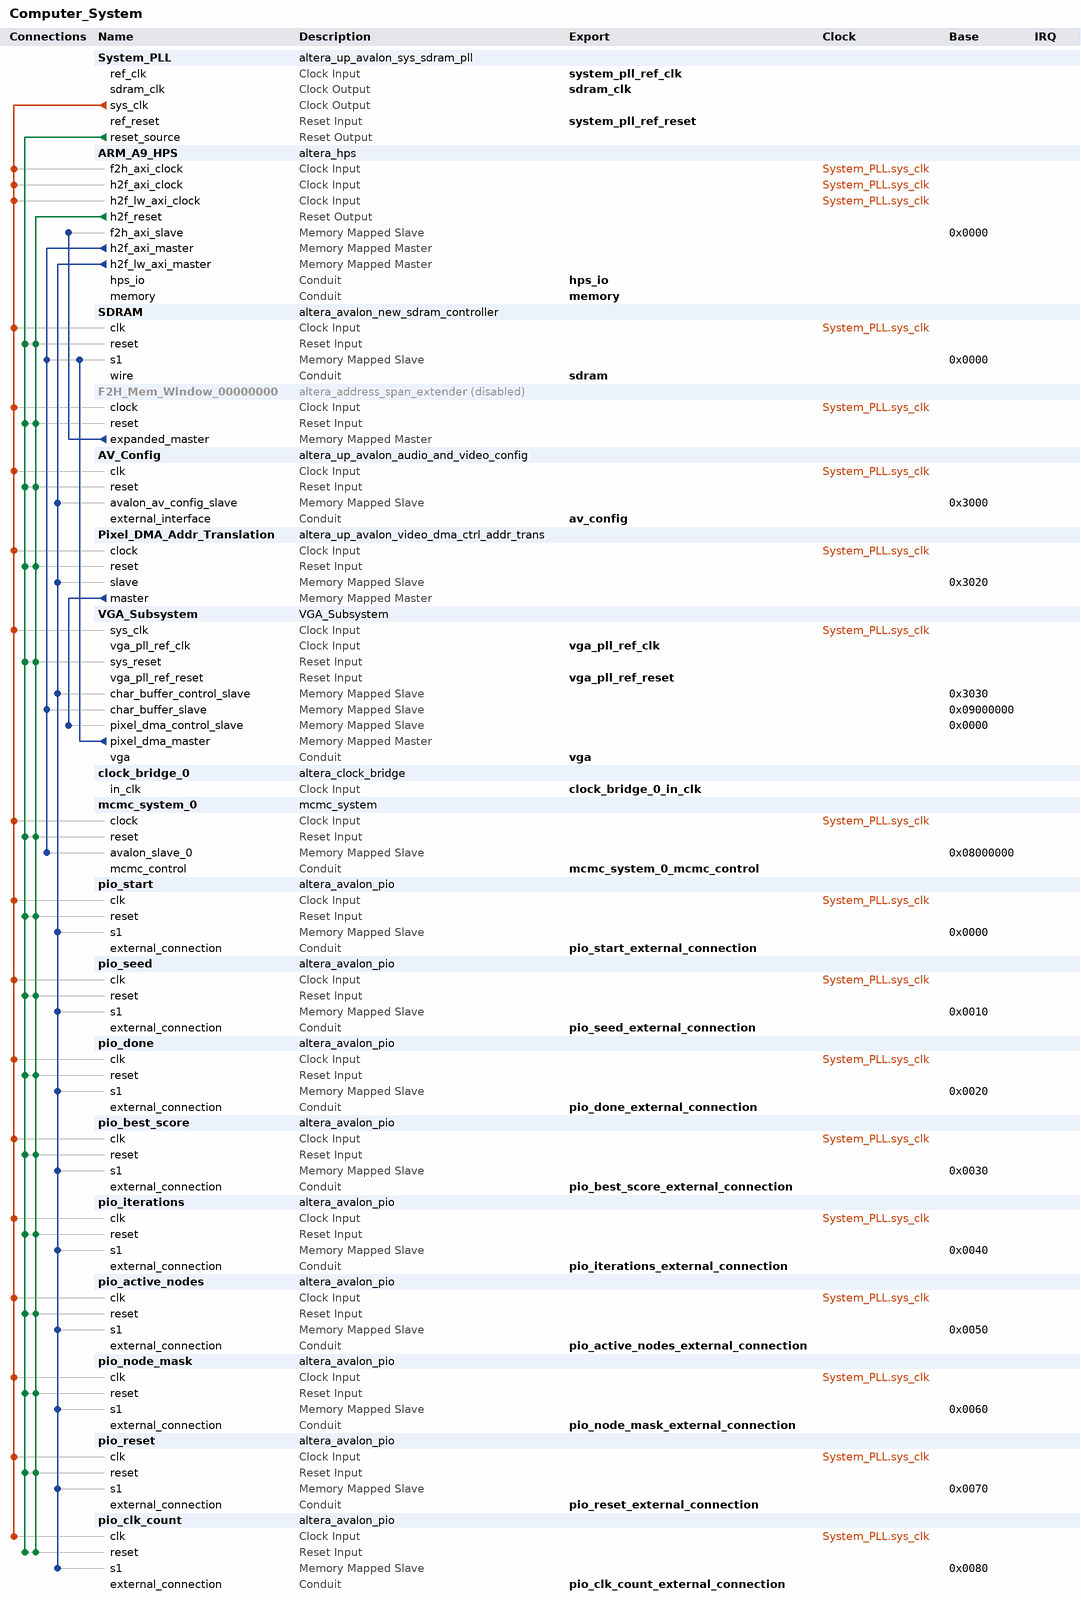
[diagram p0: system contents]
# Platform Designer (Qsys) system Computer_System, Cyclone V 5CSEMA5F31C6
# Parameters at their usual value, and those the tool derives, are not listed.
package require -exact qsys 18.1
create_system Computer_System
set_project_property DEVICE_FAMILY {Cyclone V}
set_project_property DEVICE 5CSEMA5F31C6

add_instance System_PLL altera_up_avalon_sys_sdram_pll 18.0
set_instance_parameter_value System_PLL CV_boards DE1-SoC
set_instance_parameter_value System_PLL gui_outclk 100.0
set_instance_parameter_value System_PLL gui_refclk 50.0

add_instance ARM_A9_HPS altera_hps 18.1
set_instance_parameter_value ARM_A9_HPS EMAC1_Mode RGMII
set_instance_parameter_value ARM_A9_HPS EMAC1_PinMuxing {HPS I/O Set 0}
set_instance_parameter_value ARM_A9_HPS F2SCLK_COLDRST_Enable false
set_instance_parameter_value ARM_A9_HPS F2SCLK_DBGRST_Enable false
set_instance_parameter_value ARM_A9_HPS F2SCLK_WARMRST_Enable false
set_instance_parameter_value ARM_A9_HPS F2SINTERRUPT_Enable true
set_instance_parameter_value ARM_A9_HPS F2S_Width 2
set_instance_parameter_value ARM_A9_HPS FPGA_PERIPHERAL_OUTPUT_CLOCK_FREQ_EMAC0_GTX_CLK 125
set_instance_parameter_value ARM_A9_HPS FPGA_PERIPHERAL_OUTPUT_CLOCK_FREQ_EMAC0_MD_CLK 100.0
set_instance_parameter_value ARM_A9_HPS FPGA_PERIPHERAL_OUTPUT_CLOCK_FREQ_EMAC1_GTX_CLK 125
set_instance_parameter_value ARM_A9_HPS FPGA_PERIPHERAL_OUTPUT_CLOCK_FREQ_EMAC1_MD_CLK 100.0
set_instance_parameter_value ARM_A9_HPS HPS_PROTOCOL DDR3
set_instance_parameter_value ARM_A9_HPS I2C0_Mode I2C
set_instance_parameter_value ARM_A9_HPS I2C0_PinMuxing {HPS I/O Set 0}
set_instance_parameter_value ARM_A9_HPS I2C1_Mode I2C
set_instance_parameter_value ARM_A9_HPS I2C1_PinMuxing {HPS I/O Set 0}
set_instance_parameter_value ARM_A9_HPS LWH2F_Enable true
set_instance_parameter_value ARM_A9_HPS MEM_BANKADDR_WIDTH 3
set_instance_parameter_value ARM_A9_HPS MEM_CLK_FREQ 400.0
set_instance_parameter_value ARM_A9_HPS MEM_COL_ADDR_WIDTH 10
set_instance_parameter_value ARM_A9_HPS MEM_DQ_WIDTH 32
set_instance_parameter_value ARM_A9_HPS MEM_DRV_STR RZQ/7
set_instance_parameter_value ARM_A9_HPS MEM_ROW_ADDR_WIDTH 15
set_instance_parameter_value ARM_A9_HPS MEM_RTT_NOM RZQ/4
set_instance_parameter_value ARM_A9_HPS MEM_RTT_WR RZQ/4
set_instance_parameter_value ARM_A9_HPS MEM_TCL 11
set_instance_parameter_value ARM_A9_HPS MEM_TFAW_NS 30.0
set_instance_parameter_value ARM_A9_HPS MEM_TRAS_NS 35.0
set_instance_parameter_value ARM_A9_HPS MEM_TRCD_NS 13.75
set_instance_parameter_value ARM_A9_HPS MEM_TRFC_NS 260.0
set_instance_parameter_value ARM_A9_HPS MEM_TRP_NS 13.75
set_instance_parameter_value ARM_A9_HPS MEM_VENDOR JEDEC
set_instance_parameter_value ARM_A9_HPS MEM_WTCL 8
set_instance_parameter_value ARM_A9_HPS QSPI_Mode {1 SS}
set_instance_parameter_value ARM_A9_HPS QSPI_PinMuxing {HPS I/O Set 0}
set_instance_parameter_value ARM_A9_HPS REF_CLK_FREQ 25.0
set_instance_parameter_value ARM_A9_HPS S2FCLK_USER2CLK 5
set_instance_parameter_value ARM_A9_HPS S2F_Width 3
set_instance_parameter_value ARM_A9_HPS SDIO_Mode {4-bit Data}
set_instance_parameter_value ARM_A9_HPS SDIO_PinMuxing {HPS I/O Set 0}
set_instance_parameter_value ARM_A9_HPS SPIM1_Mode {Single Slave Select}
set_instance_parameter_value ARM_A9_HPS SPIM1_PinMuxing {HPS I/O Set 0}
set_instance_parameter_value ARM_A9_HPS STM_Enable false
set_instance_parameter_value ARM_A9_HPS TIMING_BOARD_AC_SKEW 0.03
set_instance_parameter_value ARM_A9_HPS TIMING_BOARD_AC_TO_CK_SKEW 0.0
set_instance_parameter_value ARM_A9_HPS TIMING_BOARD_DQ_TO_DQS_SKEW 0.0
set_instance_parameter_value ARM_A9_HPS TIMING_BOARD_MAX_CK_DELAY 0.03
set_instance_parameter_value ARM_A9_HPS TIMING_BOARD_MAX_DQS_DELAY 0.02
set_instance_parameter_value ARM_A9_HPS TIMING_BOARD_SKEW_BETWEEN_DQS 0.08
set_instance_parameter_value ARM_A9_HPS TIMING_BOARD_SKEW_CKDQS_DIMM_MAX 0.16
set_instance_parameter_value ARM_A9_HPS TIMING_BOARD_SKEW_CKDQS_DIMM_MIN 0.09
set_instance_parameter_value ARM_A9_HPS TIMING_BOARD_SKEW_WITHIN_DQS 0.01
set_instance_parameter_value ARM_A9_HPS TIMING_TDH 65
set_instance_parameter_value ARM_A9_HPS TIMING_TDQSCK 255
set_instance_parameter_value ARM_A9_HPS TIMING_TDQSQ 125
set_instance_parameter_value ARM_A9_HPS TIMING_TDS 30
set_instance_parameter_value ARM_A9_HPS TIMING_TIH 140
set_instance_parameter_value ARM_A9_HPS TIMING_TIS 180
set_instance_parameter_value ARM_A9_HPS TIMING_TQSH 0.4
set_instance_parameter_value ARM_A9_HPS UART0_Mode {No Flow Control}
set_instance_parameter_value ARM_A9_HPS UART0_PinMuxing {HPS I/O Set 0}
set_instance_parameter_value ARM_A9_HPS USB1_Mode SDR
set_instance_parameter_value ARM_A9_HPS USB1_PinMuxing {HPS I/O Set 0}
set_instance_parameter_value ARM_A9_HPS desired_cfg_clk_mhz 100.0
set_instance_parameter_value ARM_A9_HPS desired_qspi_clk_mhz 400.0

add_instance SDRAM altera_avalon_new_sdram_controller 18.1
set_instance_parameter_value SDRAM TAC 5.5
set_instance_parameter_value SDRAM TRCD 20.0
set_instance_parameter_value SDRAM TRP 20.0
set_instance_parameter_value SDRAM casLatency 3
set_instance_parameter_value SDRAM columnWidth 10
set_instance_parameter_value SDRAM dataWidth 16
set_instance_parameter_value SDRAM generateSimulationModel true
set_instance_parameter_value SDRAM model single_Micron_MT48LC4M32B2_7_chip
set_instance_parameter_value SDRAM numberOfBanks 4
set_instance_parameter_value SDRAM numberOfChipSelects 1
set_instance_parameter_value SDRAM powerUpDelay 100.0
set_instance_parameter_value SDRAM refreshPeriod 15.625
set_instance_parameter_value SDRAM rowWidth 13

add_instance F2H_Mem_Window_00000000 altera_address_span_extender 18.1
set_instance_property F2H_Mem_Window_00000000 ENABLED false
set_instance_parameter_value F2H_Mem_Window_00000000 BURSTCOUNT_WIDTH 1
set_instance_parameter_value F2H_Mem_Window_00000000 DATA_WIDTH 32
set_instance_parameter_value F2H_Mem_Window_00000000 ENABLE_SLAVE_PORT false
set_instance_parameter_value F2H_Mem_Window_00000000 MASTER_ADDRESS_DEF 0
set_instance_parameter_value F2H_Mem_Window_00000000 MAX_PENDING_READS 1
set_instance_parameter_value F2H_Mem_Window_00000000 SLAVE_ADDRESS_WIDTH 28

add_instance AV_Config altera_up_avalon_audio_and_video_config 18.0
set_instance_parameter_value AV_Config audio_in {Microphone to ADC}
set_instance_parameter_value AV_Config bit_length 32
set_instance_parameter_value AV_Config board DE1-SoC
set_instance_parameter_value AV_Config line_in_bypass false
set_instance_parameter_value AV_Config sampling_rate {48 kHz}

add_instance Pixel_DMA_Addr_Translation altera_up_avalon_video_dma_ctrl_addr_trans 18.0

add_instance VGA_Subsystem VGA_Subsystem 1.0

add_instance clock_bridge_0 altera_clock_bridge 18.1
set_instance_parameter_value clock_bridge_0 DERIVED_CLOCK_RATE 0
set_instance_parameter_value clock_bridge_0 EXPLICIT_CLOCK_RATE 50000000

add_instance mcmc_system_0 mcmc_system 1.0
set_instance_parameter_value mcmc_system_0 N_CHAINS 1
set_instance_parameter_value mcmc_system_0 N_NODES 32

add_instance pio_start altera_avalon_pio 18.1
set_instance_parameter_value pio_start direction Output
set_instance_parameter_value pio_start width 32

add_instance pio_seed altera_avalon_pio 18.1
set_instance_parameter_value pio_seed direction Output
set_instance_parameter_value pio_seed width 32

add_instance pio_done altera_avalon_pio 18.1
set_instance_parameter_value pio_done direction Input
set_instance_parameter_value pio_done width 32

add_instance pio_best_score altera_avalon_pio 18.1
set_instance_parameter_value pio_best_score direction Input
set_instance_parameter_value pio_best_score width 32

add_instance pio_iterations altera_avalon_pio 18.1
set_instance_parameter_value pio_iterations direction Output
set_instance_parameter_value pio_iterations width 32

add_instance pio_active_nodes altera_avalon_pio 18.1
set_instance_parameter_value pio_active_nodes direction Output
set_instance_parameter_value pio_active_nodes width 32

add_instance pio_node_mask altera_avalon_pio 18.1
set_instance_parameter_value pio_node_mask direction Output
set_instance_parameter_value pio_node_mask width 32

add_instance pio_reset altera_avalon_pio 18.1
set_instance_parameter_value pio_reset direction Output
set_instance_parameter_value pio_reset width 32

add_instance pio_clk_count altera_avalon_pio 18.1
set_instance_parameter_value pio_clk_count direction Input
set_instance_parameter_value pio_clk_count width 32

# connections
add_connection System_PLL.sys_clk ARM_A9_HPS.f2h_axi_clock clock
add_connection System_PLL.sys_clk ARM_A9_HPS.h2f_axi_clock clock
add_connection System_PLL.sys_clk ARM_A9_HPS.h2f_lw_axi_clock clock
add_connection System_PLL.sys_clk AV_Config.clk clock
add_connection System_PLL.sys_clk F2H_Mem_Window_00000000.clock clock
add_connection System_PLL.sys_clk mcmc_system_0.clock clock
add_connection System_PLL.sys_clk pio_active_nodes.clk clock
add_connection System_PLL.sys_clk pio_best_score.clk clock
add_connection System_PLL.sys_clk pio_clk_count.clk clock
add_connection System_PLL.sys_clk pio_done.clk clock
add_connection System_PLL.sys_clk pio_iterations.clk clock
add_connection System_PLL.sys_clk pio_node_mask.clk clock
add_connection System_PLL.sys_clk pio_reset.clk clock
add_connection System_PLL.sys_clk pio_seed.clk clock
add_connection System_PLL.sys_clk pio_start.clk clock
add_connection System_PLL.sys_clk Pixel_DMA_Addr_Translation.clock clock
add_connection System_PLL.sys_clk SDRAM.clk clock
add_connection System_PLL.sys_clk VGA_Subsystem.sys_clk clock
add_connection ARM_A9_HPS.h2f_reset AV_Config.reset reset
add_connection ARM_A9_HPS.h2f_reset F2H_Mem_Window_00000000.reset reset
add_connection ARM_A9_HPS.h2f_reset mcmc_system_0.reset reset
add_connection ARM_A9_HPS.h2f_reset pio_active_nodes.reset reset
add_connection ARM_A9_HPS.h2f_reset pio_best_score.reset reset
add_connection ARM_A9_HPS.h2f_reset pio_clk_count.reset reset
add_connection ARM_A9_HPS.h2f_reset pio_done.reset reset
add_connection ARM_A9_HPS.h2f_reset pio_iterations.reset reset
add_connection ARM_A9_HPS.h2f_reset pio_node_mask.reset reset
add_connection ARM_A9_HPS.h2f_reset pio_reset.reset reset
add_connection ARM_A9_HPS.h2f_reset pio_seed.reset reset
add_connection ARM_A9_HPS.h2f_reset pio_start.reset reset
add_connection ARM_A9_HPS.h2f_reset Pixel_DMA_Addr_Translation.reset reset
add_connection ARM_A9_HPS.h2f_reset SDRAM.reset reset
add_connection ARM_A9_HPS.h2f_reset VGA_Subsystem.sys_reset reset
add_connection System_PLL.reset_source AV_Config.reset reset
add_connection System_PLL.reset_source F2H_Mem_Window_00000000.reset reset
add_connection System_PLL.reset_source mcmc_system_0.reset reset
add_connection System_PLL.reset_source pio_active_nodes.reset reset
add_connection System_PLL.reset_source pio_best_score.reset reset
add_connection System_PLL.reset_source pio_clk_count.reset reset
add_connection System_PLL.reset_source pio_done.reset reset
add_connection System_PLL.reset_source pio_iterations.reset reset
add_connection System_PLL.reset_source pio_node_mask.reset reset
add_connection System_PLL.reset_source pio_reset.reset reset
add_connection System_PLL.reset_source pio_seed.reset reset
add_connection System_PLL.reset_source pio_start.reset reset
add_connection System_PLL.reset_source Pixel_DMA_Addr_Translation.reset reset
add_connection System_PLL.reset_source SDRAM.reset reset
add_connection System_PLL.reset_source VGA_Subsystem.sys_reset reset
add_connection ARM_A9_HPS.h2f_axi_master mcmc_system_0.avalon_slave_0 avalon
set_connection_parameter_value ARM_A9_HPS.h2f_axi_master/mcmc_system_0.avalon_slave_0 baseAddress 0x08000000
add_connection ARM_A9_HPS.h2f_axi_master SDRAM.s1 avalon
set_connection_parameter_value ARM_A9_HPS.h2f_axi_master/SDRAM.s1 baseAddress 0x0000
add_connection ARM_A9_HPS.h2f_axi_master VGA_Subsystem.char_buffer_slave avalon
set_connection_parameter_value ARM_A9_HPS.h2f_axi_master/VGA_Subsystem.char_buffer_slave baseAddress 0x09000000
add_connection ARM_A9_HPS.h2f_lw_axi_master AV_Config.avalon_av_config_slave avalon
set_connection_parameter_value ARM_A9_HPS.h2f_lw_axi_master/AV_Config.avalon_av_config_slave baseAddress 0x3000
add_connection ARM_A9_HPS.h2f_lw_axi_master pio_active_nodes.s1 avalon
set_connection_parameter_value ARM_A9_HPS.h2f_lw_axi_master/pio_active_nodes.s1 baseAddress 0x0050
add_connection ARM_A9_HPS.h2f_lw_axi_master pio_best_score.s1 avalon
set_connection_parameter_value ARM_A9_HPS.h2f_lw_axi_master/pio_best_score.s1 baseAddress 0x0030
add_connection ARM_A9_HPS.h2f_lw_axi_master pio_clk_count.s1 avalon
set_connection_parameter_value ARM_A9_HPS.h2f_lw_axi_master/pio_clk_count.s1 baseAddress 0x0080
add_connection ARM_A9_HPS.h2f_lw_axi_master pio_done.s1 avalon
set_connection_parameter_value ARM_A9_HPS.h2f_lw_axi_master/pio_done.s1 baseAddress 0x0020
add_connection ARM_A9_HPS.h2f_lw_axi_master pio_iterations.s1 avalon
set_connection_parameter_value ARM_A9_HPS.h2f_lw_axi_master/pio_iterations.s1 baseAddress 0x0040
add_connection ARM_A9_HPS.h2f_lw_axi_master pio_node_mask.s1 avalon
set_connection_parameter_value ARM_A9_HPS.h2f_lw_axi_master/pio_node_mask.s1 baseAddress 0x0060
add_connection ARM_A9_HPS.h2f_lw_axi_master pio_reset.s1 avalon
set_connection_parameter_value ARM_A9_HPS.h2f_lw_axi_master/pio_reset.s1 baseAddress 0x0070
add_connection ARM_A9_HPS.h2f_lw_axi_master pio_seed.s1 avalon
set_connection_parameter_value ARM_A9_HPS.h2f_lw_axi_master/pio_seed.s1 baseAddress 0x0010
add_connection ARM_A9_HPS.h2f_lw_axi_master pio_start.s1 avalon
set_connection_parameter_value ARM_A9_HPS.h2f_lw_axi_master/pio_start.s1 baseAddress 0x0000
add_connection ARM_A9_HPS.h2f_lw_axi_master Pixel_DMA_Addr_Translation.slave avalon
set_connection_parameter_value ARM_A9_HPS.h2f_lw_axi_master/Pixel_DMA_Addr_Translation.slave baseAddress 0x3020
add_connection ARM_A9_HPS.h2f_lw_axi_master VGA_Subsystem.char_buffer_control_slave avalon
set_connection_parameter_value ARM_A9_HPS.h2f_lw_axi_master/VGA_Subsystem.char_buffer_control_slave baseAddress 0x3030
add_connection F2H_Mem_Window_00000000.expanded_master ARM_A9_HPS.f2h_axi_slave avalon
set_connection_parameter_value F2H_Mem_Window_00000000.expanded_master/ARM_A9_HPS.f2h_axi_slave baseAddress 0x0000
add_connection Pixel_DMA_Addr_Translation.master VGA_Subsystem.pixel_dma_control_slave avalon
set_connection_parameter_value Pixel_DMA_Addr_Translation.master/VGA_Subsystem.pixel_dma_control_slave baseAddress 0x0000
add_connection VGA_Subsystem.pixel_dma_master SDRAM.s1 avalon
set_connection_parameter_value VGA_Subsystem.pixel_dma_master/SDRAM.s1 baseAddress 0x0000

# exported interfaces
add_interface av_config conduit end
set_interface_property av_config EXPORT_OF AV_Config.external_interface
add_interface clock_bridge_0_in_clk clock sink
set_interface_property clock_bridge_0_in_clk EXPORT_OF clock_bridge_0.in_clk
add_interface hps_io conduit end
set_interface_property hps_io EXPORT_OF ARM_A9_HPS.hps_io
add_interface mcmc_system_0_mcmc_control conduit end
set_interface_property mcmc_system_0_mcmc_control EXPORT_OF mcmc_system_0.mcmc_control
add_interface memory conduit end
set_interface_property memory EXPORT_OF ARM_A9_HPS.memory
add_interface pio_active_nodes_external_connection conduit end
set_interface_property pio_active_nodes_external_connection EXPORT_OF pio_active_nodes.external_connection
add_interface pio_best_score_external_connection conduit end
set_interface_property pio_best_score_external_connection EXPORT_OF pio_best_score.external_connection
add_interface pio_clk_count_external_connection conduit end
set_interface_property pio_clk_count_external_connection EXPORT_OF pio_clk_count.external_connection
add_interface pio_done_external_connection conduit end
set_interface_property pio_done_external_connection EXPORT_OF pio_done.external_connection
add_interface pio_iterations_external_connection conduit end
set_interface_property pio_iterations_external_connection EXPORT_OF pio_iterations.external_connection
add_interface pio_node_mask_external_connection conduit end
set_interface_property pio_node_mask_external_connection EXPORT_OF pio_node_mask.external_connection
add_interface pio_reset_external_connection conduit end
set_interface_property pio_reset_external_connection EXPORT_OF pio_reset.external_connection
add_interface pio_seed_external_connection conduit end
set_interface_property pio_seed_external_connection EXPORT_OF pio_seed.external_connection
add_interface pio_start_external_connection conduit end
set_interface_property pio_start_external_connection EXPORT_OF pio_start.external_connection
add_interface sdram conduit end
set_interface_property sdram EXPORT_OF SDRAM.wire
add_interface sdram_clk clock source
set_interface_property sdram_clk EXPORT_OF System_PLL.sdram_clk
add_interface system_pll_ref_clk clock sink
set_interface_property system_pll_ref_clk EXPORT_OF System_PLL.ref_clk
add_interface system_pll_ref_reset reset sink
set_interface_property system_pll_ref_reset EXPORT_OF System_PLL.ref_reset
add_interface vga conduit end
set_interface_property vga EXPORT_OF VGA_Subsystem.vga
add_interface vga_pll_ref_clk clock sink
set_interface_property vga_pll_ref_clk EXPORT_OF VGA_Subsystem.vga_pll_ref_clk
add_interface vga_pll_ref_reset reset sink
set_interface_property vga_pll_ref_reset EXPORT_OF VGA_Subsystem.vga_pll_ref_reset

set_interconnect_requirement {$system} qsys_mm.clockCrossingAdapter HANDSHAKE
set_interconnect_requirement {$system} qsys_mm.enableEccProtection FALSE
set_interconnect_requirement {$system} qsys_mm.insertDefaultSlave FALSE
set_interconnect_requirement {$system} qsys_mm.maxAdditionalLatency 1

save_system Computer_System.qsys
